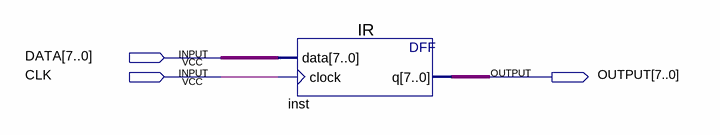
[diagram p0: schematic sheet]
// Quartus schematic T_IR.bdf as structural Verilog: 1 symbols, 3 pins
module T_IR (
  input  [7:0] DATA,
  input  CLK,
  output [7:0] OUTPUT
);

  IR inst (.data(DATA), .clock(CLK), .q(OUTPUT));
endmodule
